# EAGLE design nled-ws2801-fet-v1b (EAGLE 9.1.0)
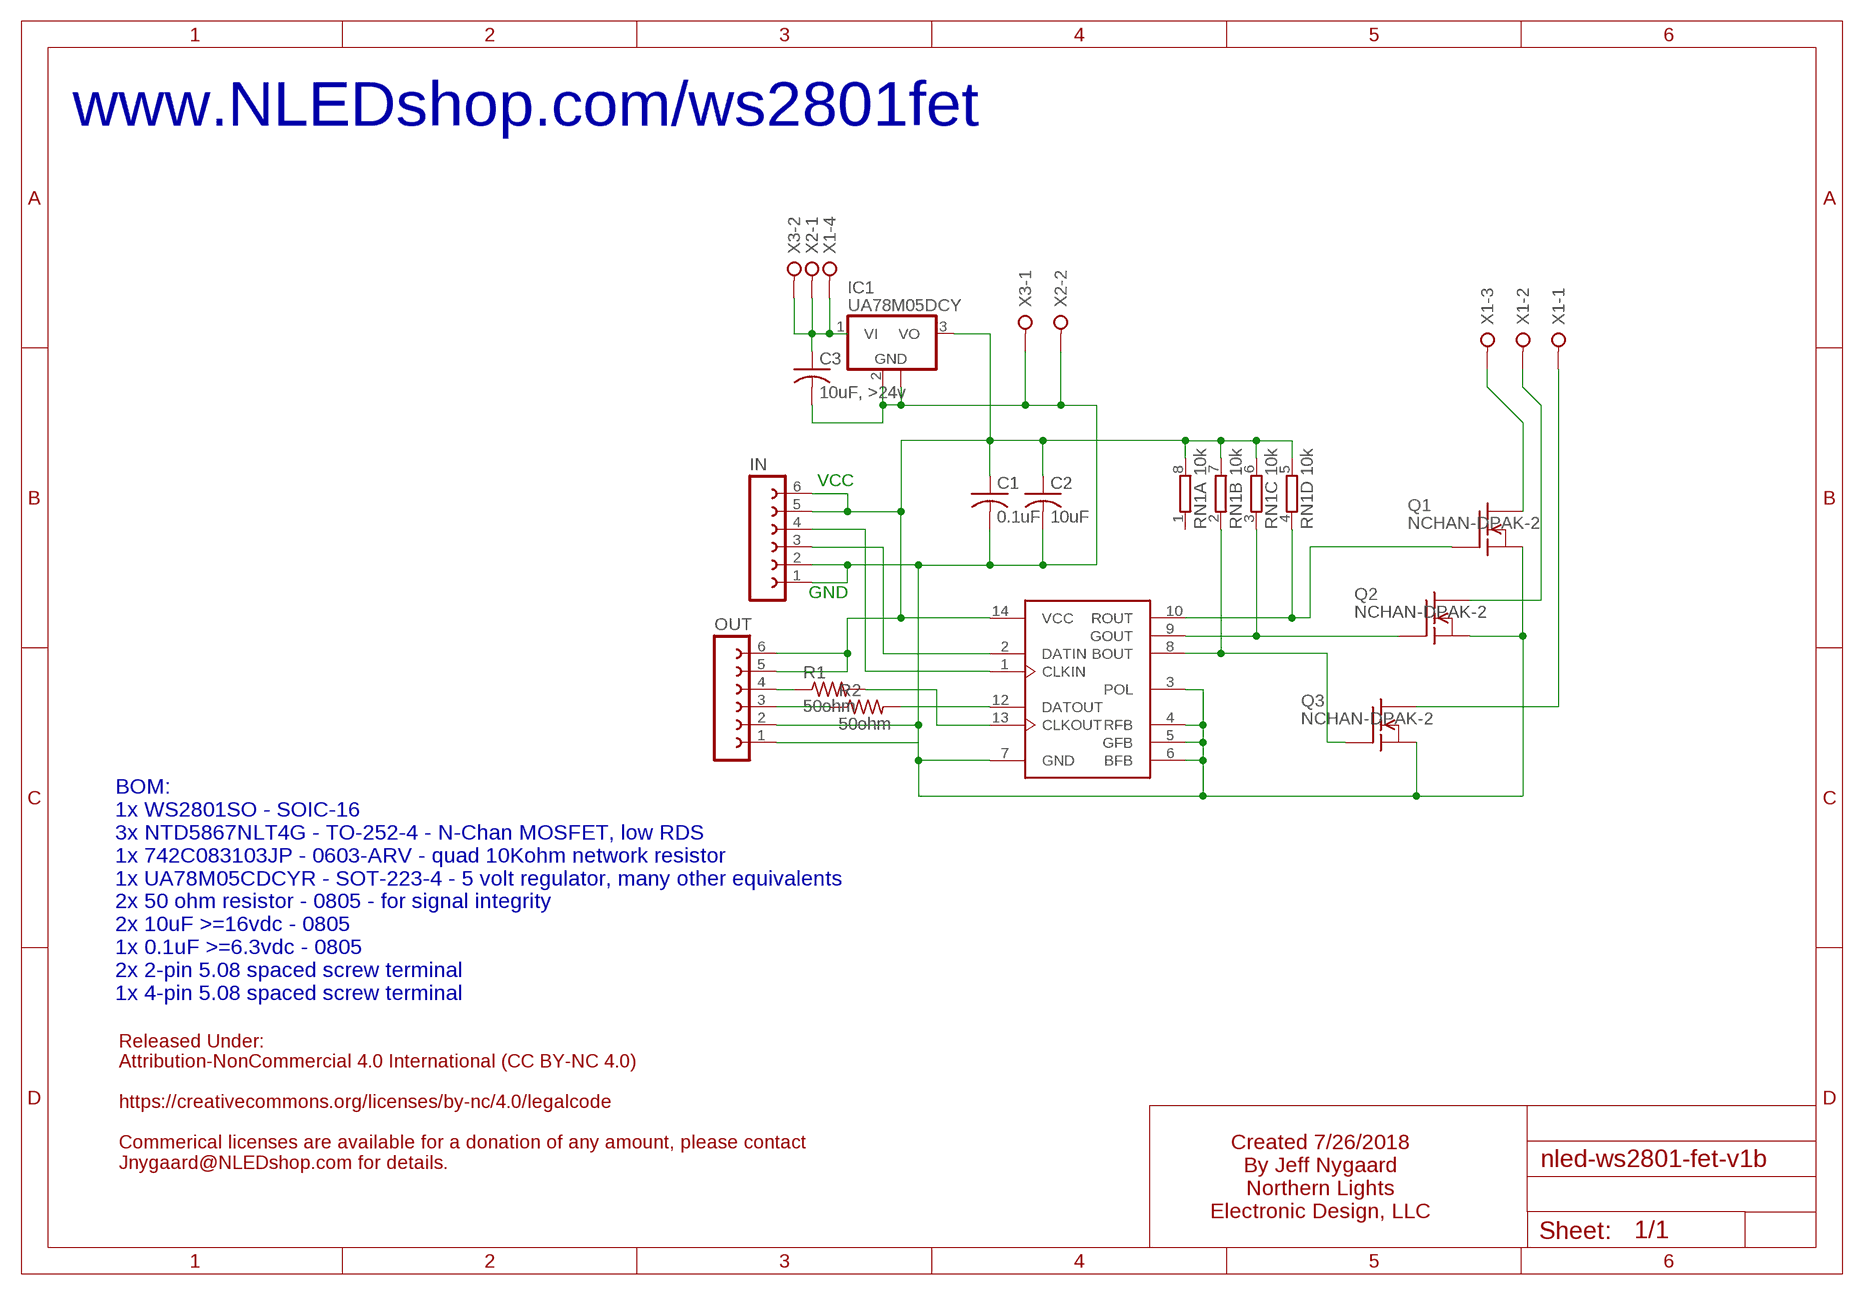
[diagram p0: schematic, sheet 1]

## Parts
C1  0.1uF  C-USC1206  [C1206]
C2  10uF  C-USC1206  [C1206]
C3  10uF, >24v  C-USC1206  [C1206]
IC1  UA78M05DCY  [SOT223]
IN  FE06-1  [FE06]
OUT  FE06-1  [FE06]
Q1  NCHAN-DPAK-2  [DPAK-2PIN]
Q2  NCHAN-DPAK-2  [DPAK-2PIN]
Q3  NCHAN-DPAK-2  [DPAK-2PIN]
R1  50ohm  R-US_M0805  [M0805]
R2  50ohm  R-US_M0805  [M0805]
RN1  10k  4R-N0603-ARV  [0603-ARV]
WS2801  WS2801  [SOP14]
X1  W237-04P  [W237-4P]
X2  W237-02P  [W237-132]
X3  W237-02P  [W237-132]

## Nets
GND: C1.2 C2.2 C3.2 IC1.2(GND) IC1.4(GND) IN.1 IN.2 OUT.1 OUT.2 Q1.3(S) Q2.3(S) Q3.3(S) WS2801.3(POL) WS2801.4(RFB) WS2801.5(GFB) WS2801.6(BFB) WS2801.7(GND) X2.2 X3.1
N$1: Q1.1(G) RN1.4 WS2801.10(ROUT)
N$2: C3.1 IC1.1(VI) X1.4 X2.1 X3.2
N$4: Q2.2(D) X1.2
N$7: IN.4 WS2801.1(CLKIN)
N$8: Q2.1(G) RN1.3 WS2801.9(GOUT)
N$9: Q3.1(G) RN1.2 WS2801.8(BOUT)
N$10: Q3.2(D) X1.1
N$11: OUT.4 R1.1
N$12: IN.3 WS2801.2(DATIN)
N$13: R1.2 WS2801.13(CLKOUT)
N$14: R2.2 WS2801.12(DATOUT)
N$15: Q1.2(D) X1.3
N$16: OUT.3 R2.1
VCC: C1.1 C2.1 IC1.3(VO) IN.5 IN.6 OUT.5 OUT.6 RN1.5 RN1.6 RN1.7 RN1.8 WS2801.14(VCC)
Unconnected: RN1.1

## Notes on the sheet
- www.NLEDshop.com/ws2801fet
- VCC
- GND
- BOM:
  1x WS2801SO - SOIC-16
  3x NTD5867NLT4G - TO-252-4 - N-Chan MOSFET, low RDS
  1x 742C083103JP - 0603-ARV - quad 10Kohm network resistor
  1x UA78M05CDCYR - SOT-223-4 - 5 volt regulator, many other equivalents
  2x 50 ohm resistor - 0805 - for signal integrity
  2x 10uF >=16vdc - 0805
  1x 0.1uF >=6.3vdc - 0805
  2x 2-pin 5.08 spaced screw terminal
  1x 4-pin 5.08 spaced screw terminal
- Released Under:
  Attribution-NonCommercial 4.0 International (CC BY-NC 4.0)
  
  https://creativecommons.org/licenses/by-nc/4.0/legalcode
  
  Commerical licenses are available for a donation of any amount, please contact
  Jnygaard@NLEDshop.com for details.
- Created 7/26/2018
  By Jeff Nygaard
  Northern Lights
  Electronic Design, LLC

## Library data of the parts
C1-C3 = rcl:C-US: CAPACITOR, American symbol
IC1 = linear:UA78M*: POSITIVE-VOLTAGE REGULATORS Source: http://focus.ti.com/lit/ds/symlink/ua78m33.pdf
IN OUT = ChromationSystems-2:FE06-1: FEMALE HEADER; OC_FARNELL: unknown; OC_NEWARK: unknown
Q1-Q3 = NLED-integratedcircuit:NCHAN-DPAK-2
R1 R2 = rcl:R-US_: RESISTOR, American symbol
RN1 = resistor-dil:4R-N: Array Chip Resistor Source: RS Component / Phycomp; OC_FARNELL: unknown; OC_NEWARK: unknown
WS2801 = BillPorter:WS2801: WS2801 3-Channel Constant Current LED Driver with PWM Outputs. Same one sold at Sparkfun and adafruit. Specs @ http://www.adafruit.com/datasheets/WS2801.pdf
X1 = con-wago-508:W237-04P: WAGO SREW CLAMP; OC_FARNELL: unknown; OC_NEWARK: unknown
X2 X3 = con-wago-508:W237-02P: WAGO SREW CLAMP; OC_FARNELL: unknown; OC_NEWARK: unknown

## Board
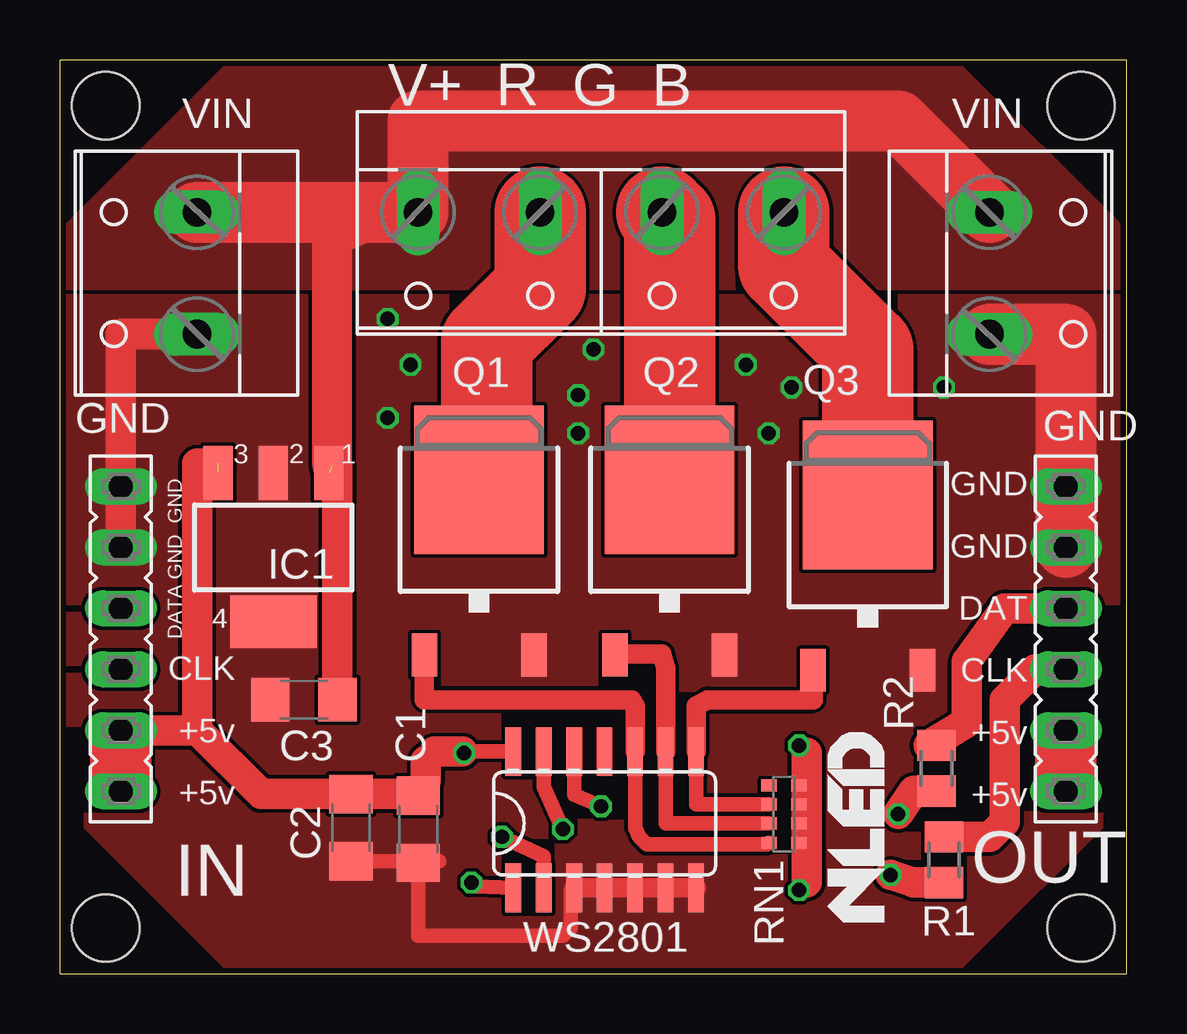
[diagram p1: board, top side]
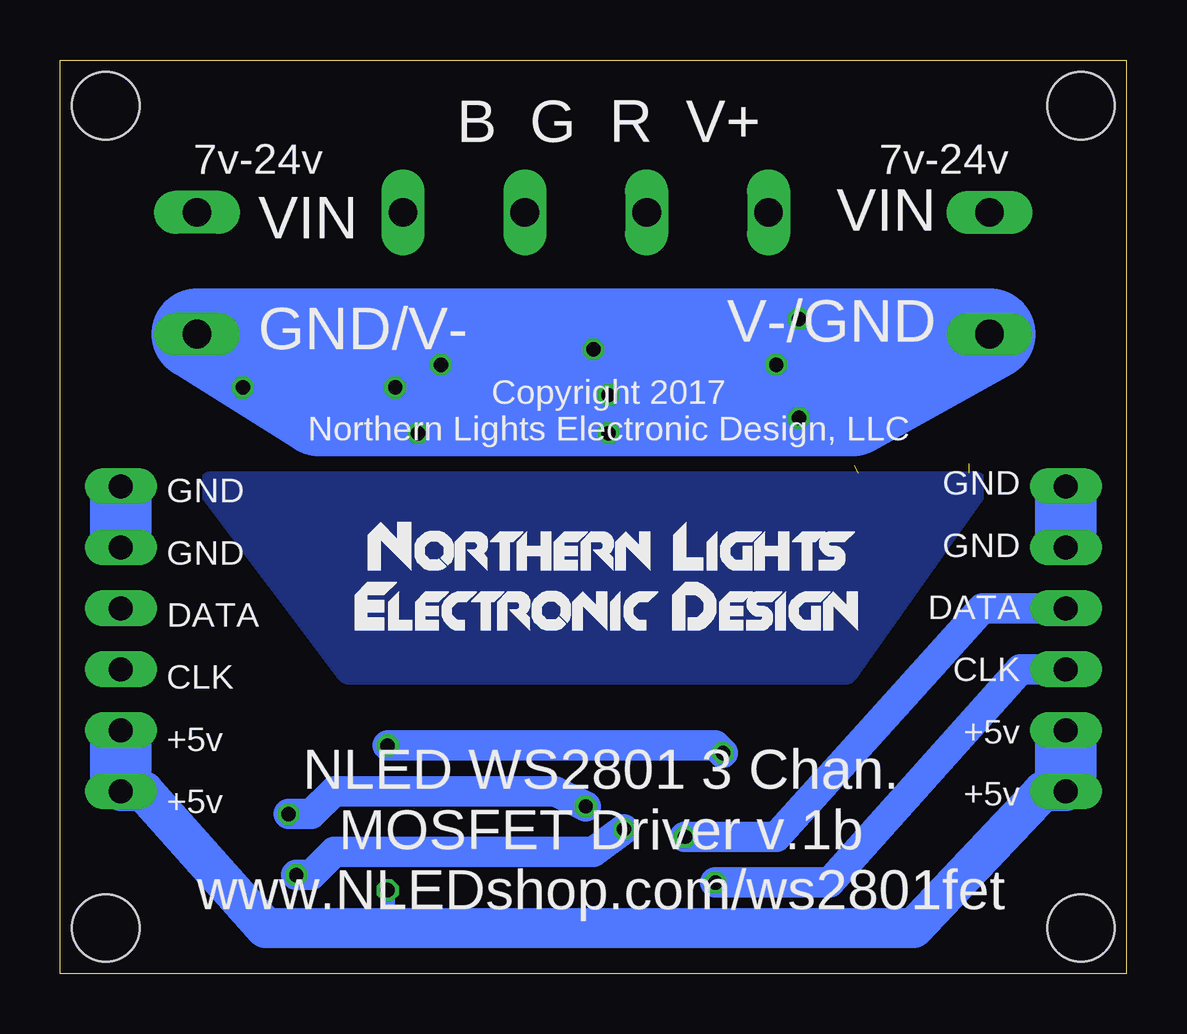
[diagram p2: board, bottom side, seen from below]

Size 44.45 x 38.1 mm. Coordinates in mm from the lower left corner, seen from the top.
Outline: 0,0 44.45,0 44.45,38.1 0,38.1 0,0
Copper layers (1*2*15*16): Top 0.035mm / dielectric 0.2mm / layer 2 0.0175mm / dielectric 1.1mm / layer 15 0.0175mm / dielectric 0.2mm / Bottom 0.035mm
Design rules "SeeedStudio_DRU_no_angle_20130527": minimum track width 6mil, minimum drill 12mil, track to track 6mil, track to pad 6mil, pad to pad 6mil, via to via 6mil, smd to smd 0mil, copper to edge 10mil, drill to drill 10mil, minimum pad ring 6mil, minimum via ring 6mil, stop-mask expansion 2mil, vias tented up to drill 25mil, thermal gap 10mil
Holes 2.8 mm at 1.91,1.91 42.55,36.2 1.91,36.2 42.55,1.91

### Footprints (pad centres in the part's own frame; a part is rotated, then mirrored left to right if it is on the bottom)
C1206 = smd 1.6 x 1.8: 1 -1.4,0; 2 1.4,0
SOT223 = smd 1.219 x 2.235: 1 -2.311,-3.099; 2 0,-3.099; 3 2.311,-3.099 | smd 3.6 x 2.2: 4 0,3.099
FE06 = drill 1 long: 1 -6.35,0; 2 -3.81,0; 3 -1.27,0; 4 1.27,0; 5 3.81,0; 6 6.35,0
DPAK-2PIN = smd 1.067 x 1.778: 1 -2.28,-6.07; 3 2.28,-6.07 | smd 5.4 x 6.2: 2 0,1.23
M0805 = smd 1.3 x 1.6: 1 -0.95,0; 2 0.95,0
0603-ARV = smd 0.5 x 0.65: 1 -1.2,-0.625; 2 -0.4,-0.625; 3 0.4,-0.625; 4 1.2,-0.625; 5 1.2,0.625; 6 0.4,0.625; 7 -0.4,0.625; 8 -1.2,0.625
SOP14 = smd 0.66 x 2.032: 1 -3.345,-2.76; 2 -2.075,-2.76; 3 -0.805,-2.76; 4 0.465,-2.76; 5 1.735,-2.76; 6 3.005,-2.76; 7 4.275,-2.76; 8 4.275,2.917; 9 3.005,2.917; 10 1.735,2.917; 11 0.465,2.917; 12 -0.805,2.917; 13 -2.075,2.917; 14 -3.345,2.917
W237-4P = drill 1.194 long: 1 -7.62,-0.635; 2 -2.54,-0.635; 3 2.54,-0.635; 4 7.62,-0.635
W237-132 = drill 1.194 long: 1 -2.54,-0.635; 2 2.54,-0.635

### Placement (x,y rotation side)
C1  14.92,6.03 270 top
C2  12.13,6.1 270 top
C3  10.16,11.43 180 top
IC1  8.89,17.78 180 top
IN  2.54,13.97 270 top
OUT  41.91,13.97 270 top
Q1  17.46,19.37 0 top
Q2  25.4,19.37 0 top
Q3  33.66,18.73 0 top
R1  36.83,4.76 270 top
R2  36.51,8.57 270 top
RN1  30.16,6.67 270 top
WS2801  22.23,6.35 0 top
X1  22.54,31.11 180 top
X2  39.37,29.21 270 top
X3  5.08,29.21 90 top

### Tracks (layer width: path | path; a pad name or v marks a point on that pad's centre or on a via)
GND  (via drill 0.6)
  Top 0.61: WS2801.3 21.27,3.44 21.27,1.91 20.95,1.59 14.92,1.59 C1.2 15.81,4.7 C2.2
  Top 0.813: WS2801.7 WS2801.6 WS2801.5 WS2801.4 WS2801.3
  Top 1.27: IN.1 IN.2 2.54,26.67 X3.1
  Top 2.54: X2.2 41.91,26.67 OUT.1 OUT.2
  Bottom 3.81: X3.1 X2.2 33.66,23.5 11.43,23.5 X3.1
  other vias: 21.59,22.54 21.59,24.13 22.23,26.04 29.53,22.54 28.57,25.4 30.48,24.45 36.83,24.45 13.65,23.18 13.65,27.3 14.61,25.4
  pour Top (rank 2, no thermals): 0,27.94 44.45,27.94 44.45,7.62 36.83,0 7.62,0 0,7.62
N$1
  Top 0.61: WS2801.10 23.96,6.09 24.13,5.71 24.45,5.4 29.47,5.4 RN1.4
  Top 0.813: WS2801.10 23.96,11.17 23.81,11.43 15.18,11.43 Q1.1
N$2  (1 unrouted)
  Top 1.27: 11.35,21.2 11.56,21.2 C3.1
  Top 1.676: 13.65,31.75 11.43,30.8 11.35,30.72 11.35,21.2
  Top 2.54: X3.2 13.65,31.75 X1.4 14.92,35.56 34.92,35.56 X2.1
  pour Top (no thermals): 0,30.48 7.62,38.1 36.83,38.1 44.45,30.48 44.45,28.89 0,28.89
N$3
  Top 1.27: 31.11,9.21 31.11,3.81
N$4
  Top 3.81: Q2.2 25.4,31.43 X1.2
N$6
  pour Bottom: 6.35,20.32 38.1,20.32 32.38,12.7 11.75,12.7
N$7  (via drill 0.6)
  Top 0.61: WS2801.1 17.29,3.66 v17.14,3.81
  Bottom 1.27: IN.4 4.45,12.7 12.38,3.81 v17.14,3.81
N$8
  Top 0.61: WS2801.9 25.23,6.27 RN1.3
  Top 0.813: WS2801.9 25.23,12.76 25.08,13.34 23.12,13.34 Q2.1
N$9
  Top 0.61: WS2801.8 26.5,7.07 RN1.2
  Top 0.813: WS2801.8 26.5,11.17 26.99,11.43 31.38,11.43 Q3.1
N$10
  Top 1.676: 33.97,20 33.7,20 Q3.2
  Top 2.54: 33.66,19.37 33.97,19.05 33.97,20 34.29,20.32
  Top 3.81: X1.1 30.16,29.53 33.66,26.04 Q3.2 33.66,19.37
N$11
  Top 1.27: R1.1 38.73,5.71 39.37,6.35 39.37,11.43 40.64,12.7 OUT.4
N$12  (via drill 0.6)
  Top 0.61: WS2801.2 20.15,4.91 v18.41,5.71
  Bottom 1.27: v18.41,5.71 14.61,5.71 6.03,15.24 IN.3
N$13  (via drill 0.6)
  Top 0.61: WS2801.13 20.15,7.79 v20.95,6.03
  Top 1.27: R1.2 35.56,3.81 v34.61,4.13
  Bottom 1.27: v34.61,4.13 33.97,4.13 33.02,5.08 22.23,5.08 v20.95,6.03
N$14  (via drill 0.6)
  Top 0.61: WS2801.12 21.42,7.47 v22.54,6.99
  Top 1.27: R2.2 35.56,7.62 v34.92,6.67
  Bottom 1.27: v34.92,6.67 33.97,6.67 33.02,7.62 23.81,7.62 v22.54,6.99
N$15
  Top 2.54: Q1.2 17.78,21.23
  Top 3.81: 17.78,21.23 17.78,26.35 20,28.57 X1.3
N$16
  Top 1.27: R2.1 36.2,9.53 37.78,10.48 37.78,13.02 39.37,15.24 OUT.3
VCC  (via drill 0.6)  (1 unrouted)
  Top 0.61: RN1.5 RN1.6 RN1.7 RN1.8 | WS2801.14 16.77,9.27 | 15.62,9.27 15.24,8.89 | 15.24,8.07 C1.1 | RN1.8 30.79,3.5 v30.8,3.49 | RN1.8 30.79,9.52 v30.8,9.53
  Top 0.813: 16.77,9.27 v16.83,9.21
  Top 1.27: IN.6 IN.5 5.71,10.16 | 5.71,10.16 5.71,21.27 6.58,21.27 | OUT.5 OUT.6 | 15.24,8.89 15.24,8.07 | 14.86,7.5 C2.1 8.38,7.5 5.71,10.16 | 15.62,9.27 16.77,9.27
  Bottom 0.61: v30.8,3.49 30.8,1.59 35.88,1.59 40.64,7.3 OUT.6
  Bottom 1.27: v30.8,9.53 17.14,9.53 v16.83,9.21
  Bottom 1.676: IN.6 3.49,7.62 8.89,1.91 35.88,1.91 40.96,7.62 OUT.6
(copper drawn outside any net)
  shapes: Bottom area x4, Top area x2

### Text on the board
tNames: V+ R G B | VIN | VIN | GND | GND | DATA GND GND | GND / GND / DAT / CLK / +5v / +5v | CLK / +5v / +5v
bNames: B G R V+ | 7v-24v | 7v-24v | VIN / / V-/GND | VIN / / GND/V- | Copyright 2017 / Northern Lights Electronic Design, LLC | GND / GND / DATA / CLK / +5v / +5v | GND / GND / DATA / CLK / +5v / +5v | NLED WS2801 3 Chan. / MOSFET Driver v.1b / www.NLEDshop.com/ws2801fet